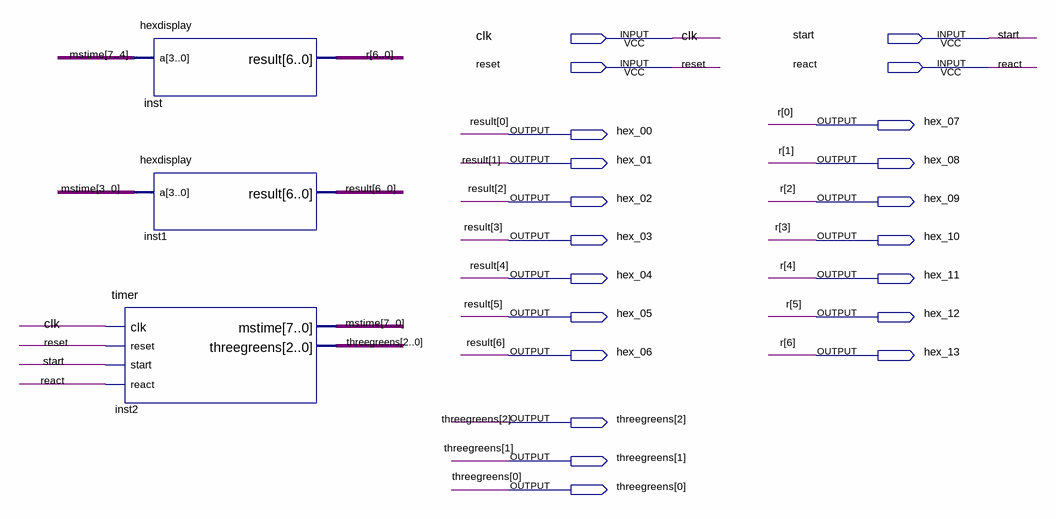
[diagram p0: schematic sheet]
// Quartus schematic reaction.bdf as structural Verilog: 3 symbols, 21 pins
module reaction (
  input  clk,
  input  start,
  input  reset,
  input  react,
  output hex_07,
  output hex_00,
  output hex_01,
  output hex_08,
  output hex_02,
  output hex_09,
  output hex_03,
  output hex_10,
  output hex_04,
  output hex_11,
  output hex_05,
  output hex_12,
  output hex_06,
  output hex_13,
  output [2:0] threegreens
);

  wire [7:0] mstime;

  hexdisplay inst (.a(mstime[7:4]), .result({hex_13, hex_12, hex_11, hex_10, hex_09, hex_08, hex_07}));
  hexdisplay inst1 (.a(mstime[3:0]), .result({hex_06, hex_05, hex_04, hex_03, hex_02, hex_01, hex_00}));
  timer inst2 (.clk(clk), .reset(reset), .start(start), .react(react), .mstime(mstime), .threegreens(threegreens));

  // Other names for the same wires on the sheet: r[6:0] = {hex_13, hex_12, hex_11, hex_10, hex_09, hex_08, hex_07};
  //   result[6:0] = {hex_06, hex_05, hex_04, hex_03, hex_02, hex_01, hex_00}
endmodule
